# EAGLE design receiver_rfm95_5v (EAGLE 7.7.0)
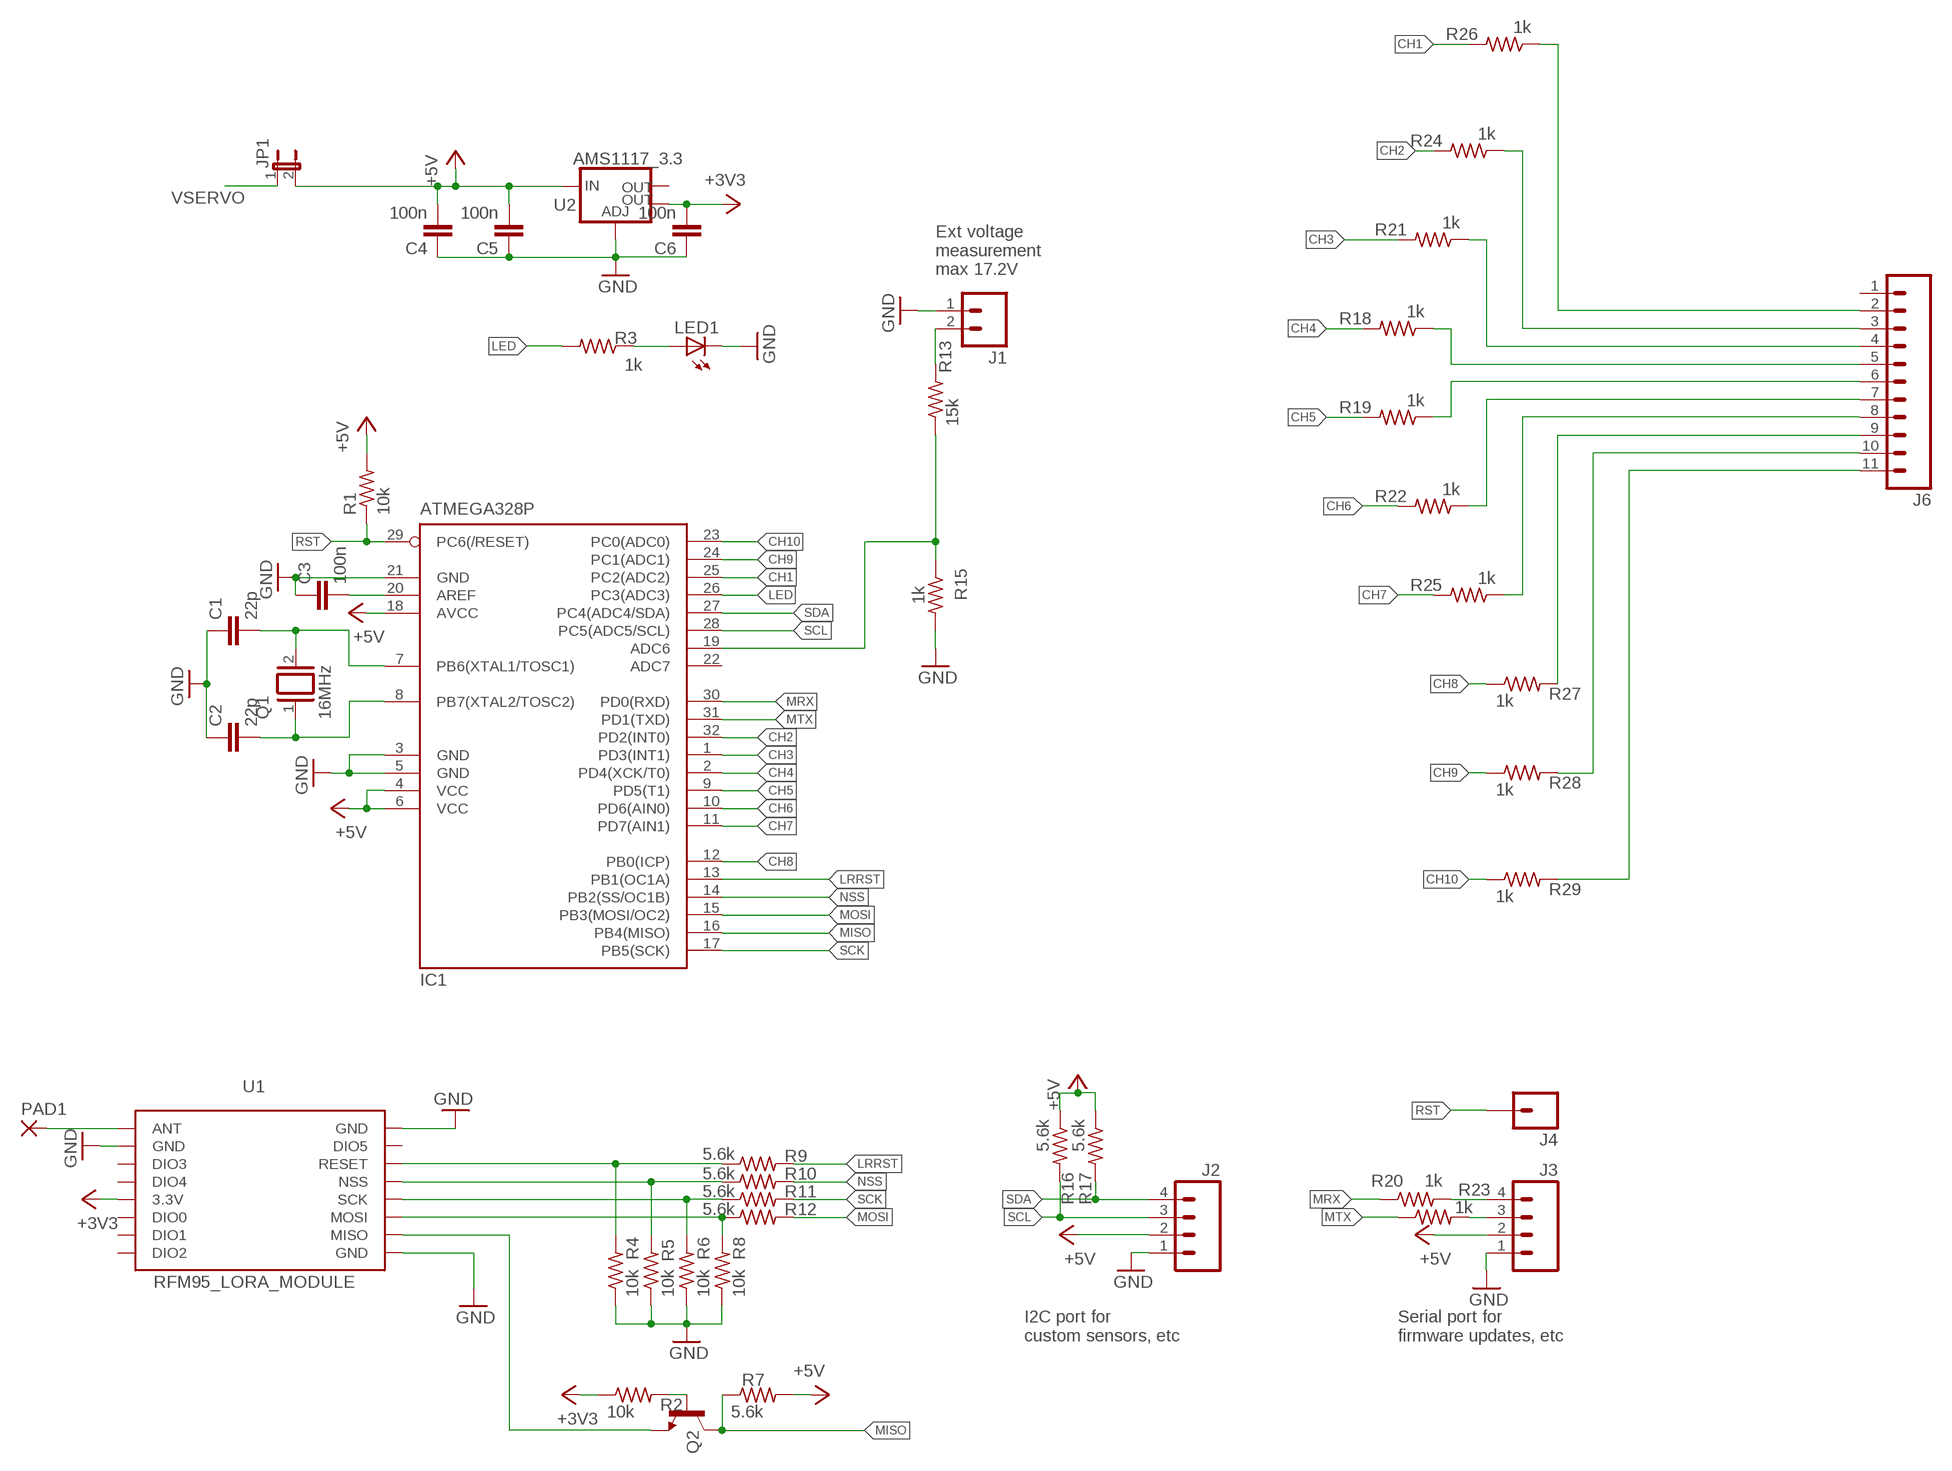
[diagram p0: schematic, sheet 1]

## Parts
C1  22p  C-EUC0805K  [C0805K]
C2  22p  C-EUC0805K  [C0805K]
C3  100n  C-EUC0805K  [C0805K]
C4  100n  C-EUC0805K  [C0805K]
C5  100n  C-EUC0805K  [C0805K]
C6  100n  C-EUC0805K  [C0805K]
IC1  ATMEGA328P  MEGA8-AI  [TQFP32-08]
J1  M02PTH  [1X02]
J2  M04PTH  [1X04]
J3  M04PTH  [1X04]
J4  M01PTH  [1X01]
J6  M11PTH  [1X11]
JP1  JP1E  [JP1]
LED1  LEDCHIPLED_1206  [CHIPLED_1206]
PAD1  2,15/1,0  [2,15/1,0]
Q1  16MHz  XTAL/S  [QS]
Q2  BC817-16SMD  [SOT23-BEC]
R1  10k  R-US_R0805  [R0805]
R2  10k  R-US_R0805  [R0805]
R3  1k  R-US_R0805  [R0805]
R4  10k  R-US_R0805  [R0805]
R5  10k  R-US_R0805  [R0805]
R6  10k  R-US_R0805  [R0805]
R7  5.6k  R-US_R0805  [R0805]
R8  10k  R-US_R0805  [R0805]
R9  5.6k  R-US_R0805  [R0805]
R10  5.6k  R-US_R0805  [R0805]
R11  5.6k  R-US_R0805  [R0805]
R12  5.6k  R-US_R0805  [R0805]
R13  15k  R-US_R0805  [R0805]
R15  1k  R-US_R0805  [R0805]
R16  5.6k  R-US_R0805  [R0805]
R17  5.6k  R-US_R0805  [R0805]
R18  1k  R-US_R0805  [R0805]
R19  1k  R-US_R0805  [R0805]
R20  1k  R-US_R0805  [R0805]
R21  1k  R-US_R0805  [R0805]
R22  1k  R-US_R0805  [R0805]
R23  1k  R-US_R0805  [R0805]
R24  1k  R-US_R0805  [R0805]
R25  1k  R-US_R0805  [R0805]
R26  1k  R-US_R0805  [R0805]
R27  1k  R-US_R0805  [R0805]
R28  1k  R-US_R0805  [R0805]
R29  1k  R-US_R0805  [R0805]
U1  RFM95_LORA_MODULE  [RFM95]
U2  AMS1117_3.3  V_REG_LM1117SOT223  [SOT223]

## Nets
+3V3: C6.2 R2.1 U1.3.3V U2.4(OUT)
+5V: C4.2 C5.2 IC1.4(VCC) IC1.6(VCC) IC1.18(AVCC) J2.2 J3.2 JP1.2 R1.2 R7.2 R16.1 R17.1 U2.3(IN)
CH1: IC1.25(PC2(ADC2)) R26.2
CH2: IC1.32(PD2(INT0)) R24.2
CH3: IC1.1(PD3(INT1)) R21.2
CH4: IC1.2(PD4(XCK/T0)) R18.2
CH5: IC1.9(PD5(T1)) R19.2
CH6: IC1.10(PD6(AIN0)) R22.2
CH7: IC1.11(PD7(AIN1)) R25.2
CH8: IC1.12(PB0(ICP)) R27.1
CH9: IC1.24(PC1(ADC1)) R28.1
CH10: IC1.23(PC0(ADC0)) R29.1
GND: C1.1 C2.1 C3.1 C4.1 C5.1 C6.1 IC1.3(GND) IC1.5(GND) IC1.21(GND) J1.1 J2.1 J3.1 LED1.C R4.1 R5.1 R6.1 R8.1 R15.2 U1.GND U1.GND@1(GND) U1.GND@2(GND) U2.1(ADJ)
LED: IC1.26(PC3(ADC3)) R3.2
LRRST: IC1.13(PB1(OC1A)) R9.2
MISO: IC1.16(PB4(MISO)) Q2.C R7.1
MOSI: IC1.15(PB3(MOSI/OC2)) R12.2
MRX: IC1.30(PD0(RXD)) R20.1
MTX: IC1.31(PD1(TXD)) R23.1
N$1: C1.2 IC1.7(PB6(XTAL1/TOSC1)) Q1.2
N$2: J6.10 R28.2
N$3: C2.2 IC1.8(PB7(XTAL2/TOSC2)) Q1.1
N$4: J6.9 R27.2
N$6: R4.2 R9.1 U1.RESET
N$7: R5.2 R10.1 U1.NSS
N$8: R6.2 R11.1 U1.SCK
N$9: R8.2 R12.1 U1.MOSI
N$11: Q2.E U1.MISO
N$12: C3.2 IC1.20(AREF)
N$13: IC1.19(ADC6) R13.1 R15.1
N$14: J3.3 R23.2
N$15: LED1.A R3.1
N$17: PAD1.1(P) U1.ANT
N$18: J6.2 R26.1
N$21: J3.4 R20.2
N$22: J6.3 R24.1
N$24: J6.4 R21.1
N$26: J6.5 R18.1
N$28: J6.6 R19.1
N$30: J6.7 R22.1
N$32: J6.8 R25.1
N$33: Q2.B R2.2
N$35: J1.2 R13.2
N$40: J6.11 R29.2
NSS: IC1.14(PB2(SS/OC1B)) R10.2
RST: IC1.29(PC6(/RESET)) J4.1 R1.1
SCK: IC1.17(PB5(SCK)) R11.2
SCL: IC1.28(PC5(ADC5/SCL)) J2.3 R16.2
SDA: IC1.27(PC4(ADC4/SDA)) J2.4 R17.2
VSERVO: JP1.1
Unconnected: IC1.22(ADC7) J6.1 U1.DIO0 U1.DIO1 U1.DIO2 U1.DIO4 U1.DIO5 U2.2(OUT)

## Notes on the sheet
- Ext voltage 
  measurement
  max 17.2V
- I2C port for
  custom sensors, etc
- Serial port for
  firmware updates, etc

## Power pins joined to a net without a drawn wire
DIO3: U1.DIO3

## Library data of the parts
C1-C6 = rcl:C-EU: CAPACITOR, European symbol
IC1 = atmel:MEGA8: MICROCONTROLLER 8 Kbytes FLASH, 1 kbytes SRAM, 512 bytes EEPROM, USART, 6-channel 10 bit ADC, 2-channel 8 bit ADC Pin compatible with Atmega48, ATMega88, ATMega168 Source: avr.lbr; MPN: ATMEGA8-16AU; OC_FARNELL: 9171371; OC_NEWARK: 73M8863
J1 = SparkFun-Connectors:M02: Standard 2-pin 0.1" header. Use with - straight break away headers ( PRT-00116) - right angle break away headers (PRT-00553) - swiss pins (PRT-00743) - machine pins (PRT-00117) - female headers (PRT-00115) Molex polarized connector foot print use with: PRT-08233 with associated crimp pins and housings. 2.54_SCREWTERM for use with PRT-10571. 3.5mm Screw Terminal footprints for PRT-08084 5mm Screw Terminal footprints for use with PRT-08432
J2 J3 = SparkFun-Connectors:M04: Header 4 Standard 4-pin 0.1" header. Use with straight break away headers (SKU : PRT-00116), right angle break away headers (PRT-00553), swiss pins (PRT-00743), machine pins (PRT-00117), and female headers (PRT-00115). Molex polarized connector foot print use with SKU : PRT-08231 with associated crimp pins and housings. 1MM SMD Version SKU: PRT-10208; PROD_ID: CONN-09696
J4 = SparkFun-Connectors:M01: Header 1 Standard 1-pin 0.1" header. Use with straight break away headers (SKU : PRT-00116), right angle break away headers (PRT-00553), swiss pins (PRT-00743), machine pins (PRT-00117), and female headers (PRT-00115). SMTSO-256-ET is a "flush mount" nut for a 4-40 screw. The older package used to be too tight, and did not allow it to sit properly thru the drill hit. The latest (0.165DIA) fits nice and snug.
J6 = SparkFun-Connectors:M11: Header 11 Standard 11-pin 0.1" header. Use with straight break away headers (SKU : PRT-00116), right angle break away headers (PRT-00553), swiss pins (PRT-00743), machine pins (PRT-00117), and female headers (PRT-00115).
JP1 = jumper:JP1E: JUMPER
LED1 = led:LED: LED OSRAM: - CHIPLED LG R971, LG N971, LY N971, LG Q971, LY Q971, LO R971, LY R971 LH N974, LH R974 LS Q976, LO Q976, LY Q976 LO Q996 - Hyper CHIPLED LW Q18S LB Q993, LB Q99A, LB R99A - SideLED LS A670, LO A670, LY A670, LG A670, LP A670 LB A673, LV A673, LT A673, LW A673 LH A674 LY A675 LS A676, LA A676, LO A676, LY A676, LW A676 LS A679, LY A679, LG A679 - Hyper Micro SIDELED® LS Y876, LA Y876, LO Y876, LY Y876 LT Y87S - SmartLED LW L88C, LW L88S LB L89C, LB L89S, LG L890 LS L89K, LO L89K, LY L89K LS L896, LA L896, LO L896, LY L896 - TOPLED LS T670, LO T670, LY T670, LG T670, LP T670 LSG T670, LSP T670, LSY T670, LOP T670, LYG T670 LG T671, LOG T671, LSG T671 LB T673, LV T673, LT T673, LW T673 LH T674 LS T676, LA T676, LO T676, LY T676, LB T676, LH T676, LSB T676, LW T676 LB T67C, LV T67C, LT T67C, LS T67K, LO T67K, LY T67K, LW E67C LS E67B, LA E67B, LO E67B, LY E67B, LB E67C, LV E67C, LT E67C LW T67C LS T679, LY T679, LG T679 LS T770, LO T770, LY T770, LG T770, LP T770 LB T773, LV T773, LT T773, LW T773 LH T774 LS E675, LA E675, LY E675, LS T675 LS T776, LA T776, LO T776, LY T776, LB T776 LHGB T686 LT T68C, LB T68C - Hyper Mini TOPLED® LB M676 - Mini TOPLED Santana® LG M470 LS M47K, LO M47K, LY M47K Source: http://www.osram.convergy.de LUXEON: - LUMILED® LXK2-PW12-R00, LXK2-PW12-S00, LXK2-PW14-U00, LXK2-PW14-V00 LXK2-PM12-R00, LXK2-PM12-S00, LXK2-PM14-U00 LXK2-PE12-Q00, LXK2-PE12-R00, LXK2-PE12-S00, LXK2-PE14-T00, LXK2-PE14-U00 LXK2-PB12-K00, LXK2-PB12-L00, LXK2-PB12-M00, LXK2-PB14-N00, LXK2-PB14-P00, LXK2-PB14-Q00 LXK2-PR12-L00, LXK2-PR12-M00, LXK2-PR14-Q00, LXK2-PR14-R00 LXK2-PD12-Q00, LXK2-PD12-R00, LXK2-PD12-S00 LXK2-PH12-R00, LXK2-PH12-S00 LXK2-PL12-P00, LXK2-PL12-Q00, LXK2-PL12-R00 Source: www.luxeon.com KINGBRIGHT: KA-3528ASYC Source: www.kingbright.com
PAD1 = wirepad:2,15/1,0: THROUGH-HOLE PAD
Q1 = special:XTAL/S: CRYSTAL
Q2 = transistor-npn:BC817*: NPN Transistor
R1-R13 R15-R29 = rcl:R-US_: RESISTOR, American symbol
U1 = RFM95_Lora_module:RFM95_LORA_MODULE
U2 = SparkFun-PowerIC:V_REG_LM1117: Voltage Regulator LM1117 Standard adjustable voltage regulator but in SMD form. Spark Fun Electronics SKU : COM-00595; PROD_ID: VREG-08170

## Net classes
1 rf: clearance 0.5 mm

## Board
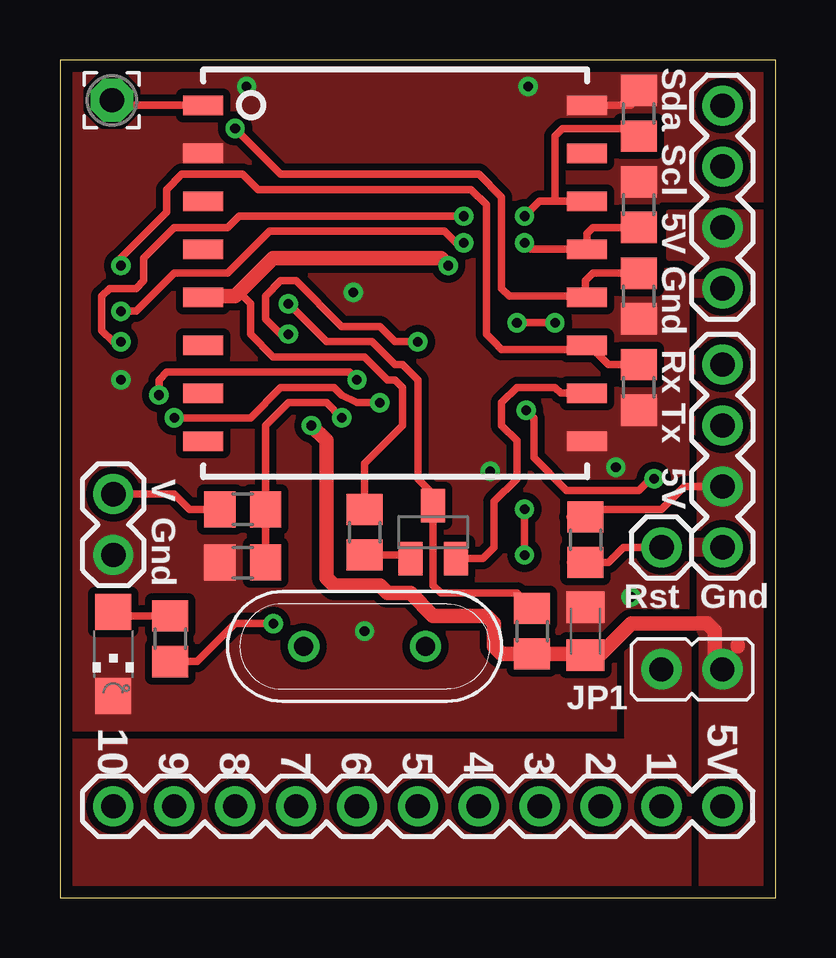
[diagram p1: board, top side]
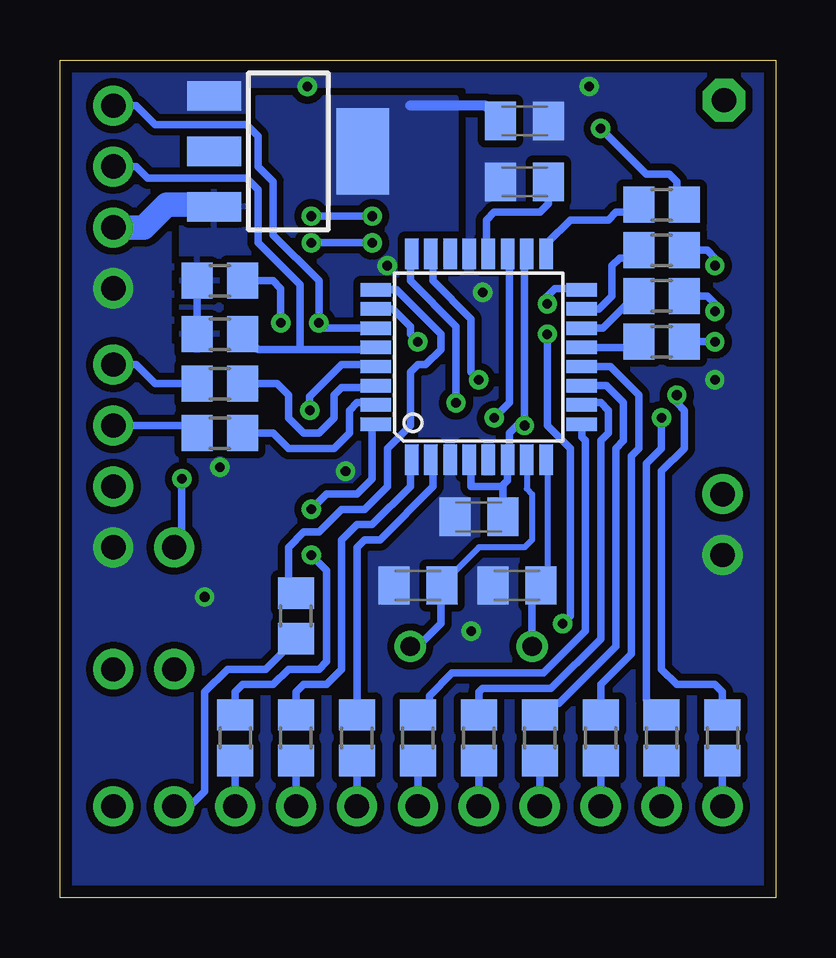
[diagram p2: board, bottom side, seen from below]

Size 29.84 x 34.92 mm. Coordinates in mm from the lower left corner, seen from the top.
Outline: 0,0 29.84,0 29.84,34.92 0,34.92 0,0
Copper layers (1*16): Top 0.035mm / dielectric 1.5mm / Bottom 0.035mm
Design rules "default *": minimum track width 10mil, minimum drill 0.4mm, track to track 0.3mm, track to pad 0.3mm, pad to pad 0.3mm, via to via 0.3mm, smd to smd 8mil, copper to edge 0.5mm, drill to drill 8mil, minimum pad ring 10mil, minimum via ring 8mil, stop-mask expansion 4mil, vias tented up to drill 0.8mm, thermal gap 10mil

### Footprints (pad centres in the part's own frame; a part is rotated, then mirrored left to right if it is on the bottom)
C0805K = smd 1.3 x 1.6: 1 -1,0; 2 1,0
TQFP32-08 = smd 1.27 x 0.559: 1 -4.293,2.8; 2 -4.293,2; 3 -4.293,1.2; 4 -4.293,0.4; 5 -4.293,-0.4; 6 -4.293,-1.2; 7 -4.293,-2; 8 -4.293,-2.8; 17 4.293,-2.8; 18 4.293,-2; 19 4.293,-1.2; 20 4.293,-0.4; 21 4.293,0.4; 22 4.293,1.2; 23 4.293,2; 24 4.293,2.8 | smd 0.559 x 1.27: 9 -2.8,-4.293; 10 -2,-4.293; 11 -1.2,-4.293; 12 -0.4,-4.293; 13 0.4,-4.293; 14 1.2,-4.293; 15 2,-4.293; 16 2.8,-4.293; 25 2.8,4.293; 26 2,4.293; 27 1.2,4.293; 28 0.4,4.293; 29 -0.4,4.293; 30 -1.2,4.293; 31 -2,4.293; 32 -2.8,4.293
1X02 = drill 1.016 pad 1.676: 1 0,0; 2 2.54,0
1X04 = drill 1.016 pad 1.676: 1 0,0; 2 2.54,0; 3 5.08,0; 4 7.62,0
1X01 = drill 1.016 pad 1.676: 1 0,0
1X11 = drill 1.016 pad 1.676: 1 0,0; 2 2.54,0; 3 5.08,0; 4 7.62,0; 5 10.16,0; 6 12.7,0; 7 15.24,0; 8 17.78,0; 9 20.32,0; 10 22.86,0; 11 25.4,0
JP1 = drill 1 pad 1.676: 1 0,-1.27; 2 0,1.27
CHIPLED_1206 = smd 1.5 x 1.5: A 0,-1.75; C 0,1.75
2,15/1,0 = drill 1.016 pad 1.778 octagon: 1 0,0
QS = drill 0.8: 1 -2.54,0; 2 2.54,0
SOT23-BEC = smd 1 x 1.4: B -0.95,-1.1; C 0,1.1; E 0.95,-1.1
R0805 = smd 1.3 x 1.5: 1 -0.95,0; 2 0.95,0
RFM95 = smd 1.676 x 0.813: 3.3V -8,-1; ANT -8,7; DIO0 -8,-3; DIO1 -8,-5; DIO2 -8,-7; DIO3 -8,3; DIO4 -8,1; DIO5 8,5; GND -8,5; GND@1 8,7; GND@2 8,-7; MISO 8,-5; MOSI 8,-3; NSS 8,1; RESET 8,3; SCK 8,-1
SOT223 = smd 1.219 x 2.235: 1 -2.311,-3.099; 2 0,-3.099; 3 2.311,-3.099 | smd 3.6 x 2.2: 4 0,3.099

### Placement (x,y rotation side)
C1  14.92,13.02 0 bottom
C2  10.79,13.02 0 bottom
C3  10.48,29.84 0 bottom
C4  12.38,15.88 0 bottom
C5  21.91,11.11 270 top
C6  10.48,32.38 180 bottom
IC1  12.38,22.54 90 bottom
J1  2.22,14.29 90 top
J2  27.62,25.4 90 top
J3  27.62,14.61 90 top
J4  25.08,14.61 0 top
J6  27.62,3.81 180 top
JP1  26.35,9.53 270 top
LED1  2.22,10.16 180 top
PAD1  2.16,33.25 0 top
Q1  12.7,10.48 0 top
Q2  15.56,15.24 0 top
R1  21.91,14.92 90 top
R2  12.7,15.24 270 top
R3  4.6,10.79 270 top
R4  24.13,32.7 270 top
R5  24.13,28.89 270 top
R6  24.13,25.08 90 top
R7  19.68,11.11 270 top
R8  24.13,21.27 90 top
R9  4.76,23.18 180 bottom
R10  4.76,25.08 180 bottom
R11  4.76,28.89 180 bottom
R12  4.76,26.99 180 bottom
R13  7.62,16.19 180 top
R15  7.62,13.97 180 top
R16  23.18,23.5 0 bottom
R17  23.18,25.72 0 bottom
R18  17.46,6.67 90 bottom
R19  14.92,6.67 90 bottom
R20  23.18,21.43 180 bottom
R21  20,6.67 90 bottom
R22  12.38,6.67 90 bottom
R23  23.18,19.37 180 bottom
R24  22.54,6.67 90 bottom
R25  9.84,6.67 90 bottom
R26  20,11.75 90 bottom
R27  7.3,6.67 270 bottom
R28  4.76,6.67 270 bottom
R29  2.22,6.67 270 bottom
U1  13.97,26.04 0 top
U2  20.32,31.11 270 bottom

### Tracks (layer width: path | path; a pad name or v marks a point on that pad's centre or on a via)
+3V3  (via drill 0.4)
  Top 0.305: 6.4,25.04 U1.3.3V | R2.1 12.7,18.1 14.29,19.68 14.29,21.27 13.97,21.59 13.65,21.59 12.7,22.54 8.89,22.54 7.94,23.5 7.94,24.77 7.46,25.24
  Top 0.61: 6.4,25.04 6.45,25.08 | v16.19,26.35 15.88,26.67 8.89,26.67 7.46,25.24 7.3,25.08 6.67,25.08 6.62,25.04 U1.3.3V
  Bottom 0.406: C6.2 12.11,33.02 15.24,33.02
  pour Bottom (isolate 0.254, rank 2, no thermals): 13.34,33.34 21.59,33.34 21.59,30.16 20.64,28.57 20.32,24.13 13.34,24.13
+5V  (via drill 0.4)
  Top 0.305: J3.2 26.04,17.14 25.08,16.19 22.54,16.19 22.22,15.87 R1.2 21.27,15.88
  Top 0.61: 28.26,10.54 28.26,10.48 | 21.86,10.16 C5.2 | v10.48,19.68 11.11,19.05 11.11,13.34 11.43,13.02 13.34,13.02 13.65,12.7 14.61,12.7 15.56,11.75 17.78,11.75 18.1,11.43 18.1,10.48 18.41,10.16 R7.2 21.86,10.16 | 21.86,10.16 22.55,10.16 23.81,11.43 26.99,11.43 27.3,11.11 27.3,9.84 JP1.2
  Bottom 0.305: R17.1 R16.1 | IC1.6 11.11,18.18 | IC1.18 10.48,26.74 v10.48,19.68 10.79,19.68 11.11,19.37 11.11,18.32 IC1.6 | IC1.6 11.18,17.39 11.43,17.14 | 11.43,17.14 12.7,17.14 12.7,18.17 IC1.4 | C4.2 11.38,17.1 11.43,17.14
  Bottom 1.016: U2.3 23.51,28.89 25.4,28.89 26.35,27.94 J2.2
  pour Top (isolate 0.254, rank 2, no thermals): 26.67,-0.32 26.67,26.35 26.04,26.67 25.4,26.67 25.4,28.57 29.53,28.57 29.53,-0.32
  pour Bottom (isolate 0.254): 21.27,22.86 21.27,29.21 21.59,29.53 24.77,29.53 24.77,22.86
CH1
  Bottom 0.305: IC1.25 15.82,25.34 13.97,23.5 13.97,22.86 14.61,22.23 14.92,22.23 15.24,21.91 15.24,19.68 16.19,18.73 16.19,17.14 17.14,16.19 18.1,16.19 19.05,15.24 19.68,15.24 20.32,14.61 20.32,13.02 R26.2
CH2  (via drill 0.4)
  Top 0.305: v19.37,16.19 v19.37,14.29
  Bottom 0.305: v19.37,14.29 18.73,13.65 18.73,9.84 19.05,9.53 20.32,9.53 20.95,8.89 22.23,8.89 22.54,8.57 R24.2 | IC1.32 16.83,19.59 16.83,17.46 17.46,16.83 18.73,16.83 v19.37,16.19
CH3
  Bottom 0.305: IC1.1 15.24,18.19 15.24,17.14 16.83,15.56 17.46,15.56 18.1,14.92 18.1,9.53 18.73,8.89 19.68,8.89 20,8.57 R21.2
CH4
  Bottom 0.305: IC1.2 14.38,17.88 14.29,17.78 14.29,17.14 16.51,14.92 17.14,14.92 17.46,14.61 R18.2
CH5
  Bottom 0.305: IC1.9 8.09,19.2 7.94,19.05 7.94,11.11 9.68,9.37 13.49,9.37 14.45,8.41 14.45,7.94 14.77,7.62 R19.2
CH6
  Bottom 0.305: IC1.10 8,20.64 7.3,20.64 6.99,20.32 6.99,19.37 7.3,19.05 7.3,10.79 9.37,8.73 12.22,8.73 12.38,8.57 R22.2
CH7
  Bottom 0.305: IC1.11 7.05,21.34 6.35,20.64 6.35,19.05 6.67,18.73 6.67,10.48 9.05,8.1 9.36,8.1 R25.2
CH8
  Bottom 0.305: IC1.12 6.9,22.14 5.71,20.95 5.71,18.73 6.03,18.41 6.03,10.16 7.3,8.89 R27.1
CH9  (via drill 0.4)
  Top 0.305: v4.76,20 7.94,20 9.21,21.27 11.43,21.27 11.75,20.95 12.38,20.64 v13.34,20.64
  Bottom 0.305: v4.76,20 4.76,18.73 5.4,18.1 5.4,8.25 R28.1 | IC1.24 15.24,26.78 15.24,25.72 13.34,23.81 v13.34,20.64
CH10  (via drill 0.4)
  Top 0.305: 4.13,21.27 v4.13,20.95 4.13,21.59 4.45,21.91 12.06,21.91 v12.38,21.59
  Bottom 0.305: v4.13,20.95 4.13,20.64 3.81,20.32 3.81,18.73 4.76,17.78 4.76,9.53 4.13,8.89 2.54,8.89 2.22,8.57 R29.1 | IC1.23 14.29,26.74 14.29,25.72 12.7,24.13 12.7,21.91 v12.38,21.59
GND  (via drill 0.4)
  Top 0.305: U1.GND@1 23.8,33.03 R4.1
  other vias: 2.54,21.59 23.18,17.94 17.94,17.78 12.7,11.11 19.53,33.81 7.78,33.81 12.22,25.24 23.81,12.54
  pour Top (isolate 0.254, rank 3, no thermals): 0,34.92 29.84,34.92 29.84,0 0,0
  pour Bottom (isolate 0.254, rank 3, no thermals): 0,34.92 29.84,34.92 29.84,0 0,0
LED  (via drill 0.4)
  Top 0.305: v14.92,23.18 13.97,23.18 13.34,23.81 11.75,23.81 9.84,25.72 9.21,25.72 8.57,25.08 8.57,24.13 9.21,23.5 v9.53,23.5 | v8.89,11.43 7.3,11.43 5.71,9.84 R3.2
  Bottom 0.305: IC1.26 15.97,24.54 15.24,23.81 15.24,23.5 v14.92,23.18 | v9.53,23.5 9.53,19.68 8.57,18.73 8.57,11.75 v8.89,11.43
LRRST
  Bottom 0.305: IC1.13 5.95,22.94 R9.2
MISO  (via drill 0.4)
  Top 0.305: v9.53,24.77 11.11,23.18 13.02,23.18 13.97,22.23 14.29,22.23 14.92,21.59 14.92,17.46 15.56,16.83 Q2.C 15.56,13.02 15.88,12.7 19.05,12.7 R7.1
  Bottom 0.305: v9.53,24.77 9.53,25.08 9.21,25.4 8.15,25.4 IC1.16
MOSI
  Bottom 0.305: IC1.15 7.37,24.54 6.83,25.08 6.83,26.35 6.51,26.67 6.03,26.67 R12.2
MRX
  Bottom 0.305: 22.46,21.34 R20.1 20.8,21.43 20.32,20.95 20.32,20 19.68,19.37 19.05,19.37 18.41,20 18.41,20.95 18.1,21.27 16.75,21.27 IC1.30
MTX
  Bottom 0.305: IC1.31 16.77,20.64 17.46,20.64 17.78,20.32 17.78,19.37 18.41,18.73 20.32,18.73 20.95,19.37 R23.1
N$1
  Bottom 0.254: IC1.7 10.38,17.05 10.16,16.83 10.16,14.92 10.48,14.61 12.38,14.61 13.65,13.34 13.65,13.29 C1.2
  Bottom 0.305: C1.2 13.97,12.97 13.97,11.43 14.92,10.48 Q1.2
N$2
  Bottom 0.305: R28.2 J6.10
N$3
  Bottom 0.254: 9.53,18.19 9.53,13.29 C2.2
  Bottom 0.305: 9.53,18.19 IC1.8 | C2.2 10.16,12.65 Q1.1
N$4
  Bottom 0.305: R27.2 J6.9
N$6  (via drill 0.4)
  Top 0.305: U1.RESET 21.83,28.89 | 22.05,29.04 U1.RESET | R4.2 23.82,32.07 20.95,32.07 20.64,31.75 20.64,29.04 | 21.77,29.04 U1.RESET | v2.54,23.18 2.22,23.18 1.75,23.65 1.75,25.08 2.06,25.4 3.17,25.4 3.49,25.72 3.49,26.67 4.76,27.94 6.99,27.94 7.46,28.42 v16.83,28.42 | v19.37,28.42 19.99,29.04 20.64,29.04 | 20.64,29.04 U1.RESET
  Bottom 0.305: v19.37,28.42 v16.83,28.42 | R9.1 v2.54,23.18
N$7  (via drill 0.4)
  Top 0.305: U1.NSS 21.92,26.99 | R5.2 22.23,27.94 21.97,27.68 U1.NSS | v2.54,24.45 3.17,24.45 4.76,26.04 6.99,26.04 8.73,27.78 16.03,27.78 16.51,27.3 v16.83,27.3 | v19.37,27.3 19.64,27.04 U1.NSS
  Bottom 0.305: v19.37,27.3 v16.83,27.3 | v2.54,24.45 2.54,24.77 2.86,25.08 R10.1
N$8  (via drill 0.4)
  Top 0.305: R6.2 22.23,26.04 21.91,25.72 21.91,25.1 21.92,25.08 | 21.97,25.14 U1.SCK 21.92,25.08 | 21.92,25.08 18.73,25.08 18.41,25.4 18.41,29.21 17.46,30.16 9.21,30.16 v7.3,32.07
  Bottom 0.305: v7.3,32.07 5.4,30.16 4.45,30.16 4.13,29.84 4.13,29.21 R11.1
N$9  (via drill 0.4)
  Top 0.305: v2.54,26.35 2.54,26.67 4.45,28.57 4.45,29.53 5.08,30.16 7.62,30.16 8.26,29.53 17.14,29.53 17.78,28.89 17.78,23.5 17.94,23.34 18.1,23.18 18.41,22.86 21.8,22.86 U1.MOSI 22.05,23.04 22.86,22.23 R8.2
  Bottom 0.305: v2.54,26.35 2.54,26.67 2.86,26.99 R12.1
N$11
  Top 0.305: U1.MISO 20.88,21.04 20.64,21.27 19.05,21.27 18.41,20.64 18.41,19.68 19.05,19.05 19.05,17.46 18.1,16.51 18.1,14.61 17.63,14.14 Q2.E
N$12
  Bottom 0.305: IC1.20 11.91,26.91 12.06,27.07 12.06,28.26 11.75,28.57 9.84,28.57 9.48,28.94 C3.2
N$13  (via drill 0.4)
  Top 0.305: R15.1 R13.1 8.57,19.68 9.53,20.64 11.11,20.64 v11.75,20
  Bottom 0.305: IC1.19 11.11,26.77 11.11,20.64 v11.75,20
N$14
  Bottom 0.305: J3.3 24.76,19.68 R23.2
N$15
  Top 0.305: R3.1 2.39,11.74 LED1.A
N$17
  Top 0.305: U1.ANT 2.37,33.03 arc-90 PAD1.1
N$18
  Bottom 0.305: R26.1 21.27,9.53 22.86,9.53 23.81,8.57 23.81,4.45 24.45,3.81 J6.2
N$21
  Bottom 0.305: R20.2 25.88,21.43 26.67,22.23 J3.4
N$22
  Bottom 0.305: R24.1 J6.3
N$24
  Bottom 0.305: R21.1 J6.4
N$26
  Bottom 0.305: R18.1 J6.5
N$28
  Bottom 0.305: R19.1 J6.6
N$30
  Bottom 0.305: R22.1 J6.7
N$32
  Bottom 0.305: R25.1 J6.8
N$33
  Top 0.305: Q2.B 14.46,14.29 R2.2
N$35
  Top 0.305: J1.2 4.76,16.83 5.4,16.19 R13.2
N$40
  Bottom 0.305: R29.2 J6.11
NSS
  Bottom 0.305: IC1.14 7.21,23.74 5.87,25.08 R10.2
RST  (via drill 0.4)
  Top 0.305: R1.1 21.27,13.97 22.86,13.97 23.5,14.61 J4.1 | v24.77,17.46 24.61,17.46 24.13,16.99 21.11,16.99 19.75,18.35 19.75,20 v19.43,20.32
  Bottom 0.305: v24.77,17.46 24.77,14.92 J4.1 | IC1.29 16.76,22.23 18.1,22.23 19.43,20.89 v19.43,20.32
SCK
  Bottom 0.305: R11.2 6.03,28.57 6.67,28.57 6.99,28.26 8.57,28.26 9.53,27.3 9.53,26.89 IC1.17
SCL
  Bottom 0.305: 19.84,22.86 19.84,25.56 21.59,27.3 21.59,29.53 22.07,30 26.19,30 26.67,30.48 J2.3 | IC1.28 16.76,22.86 19.84,22.86 | 19.84,22.86 21.59,22.86 R16.2
SDA  (via drill 0.4)
  Top 0.305: v20.64,23.97 v19.05,23.97
  Bottom 0.305: R17.2 20.95,25.72 20.64,25.4 v20.64,23.97 | IC1.27 18.82,23.74 v19.05,23.97 19.05,25.72 20.95,27.62 20.95,29.84 21.59,30.48 21.59,31.75 22.07,32.23 25.88,32.23 26.67,33.02 J2.4
VSERVO
  pour Top (isolate 0.254, no thermals): 26.04,10.79 26.19,10.64 26.19,0.16 0,0.16 0,6.51 23.65,6.51 23.65,10.64 23.81,10.79

### Text on the board
tPlace: 5V / 1 / 2 / 3 / 4 / 5 / 6 / 7 / 8 / 9 / 10
tNames: Sda | Scl | 5V | Gnd | Rx | Tx | 5V | V | Gnd | Rst | Gnd